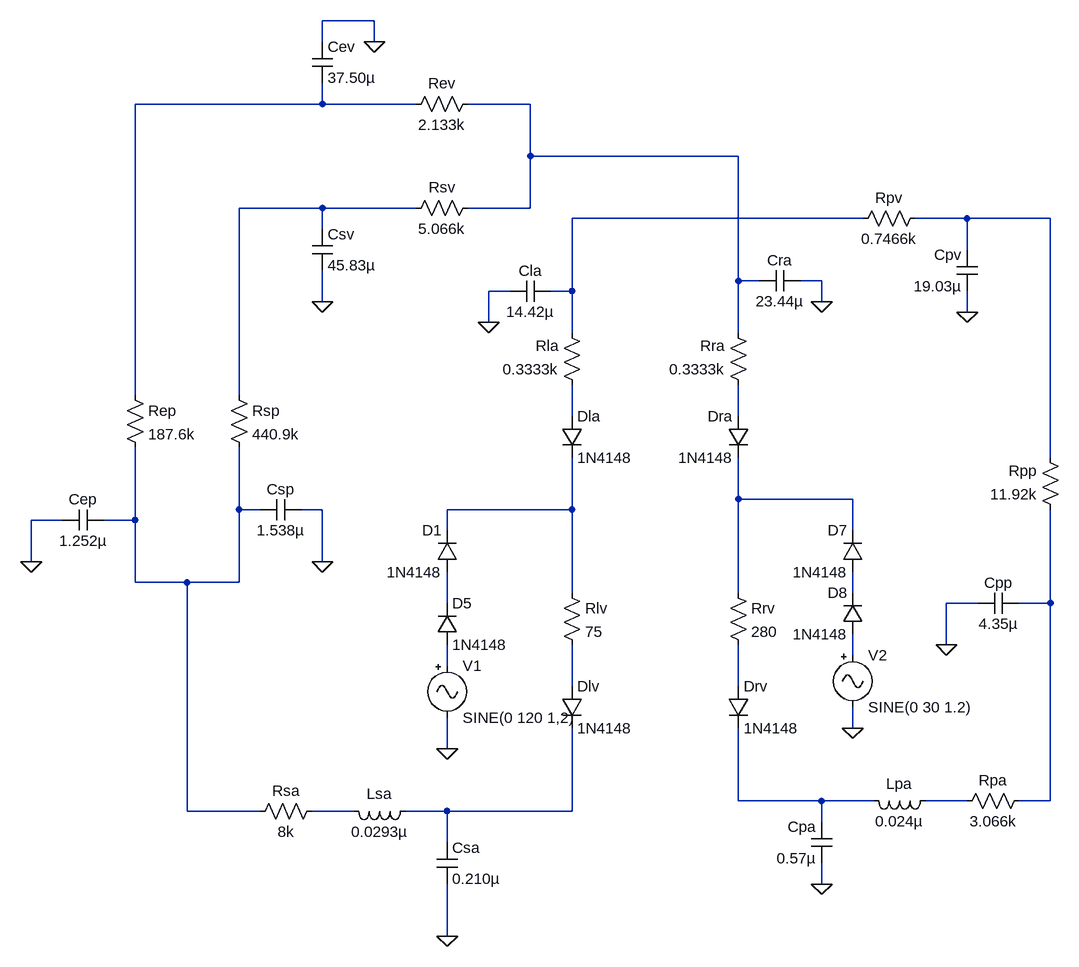
[diagram p0: schematic circuitop.asc]
circuitop.asc, the LTspice schematic file:
Version 4
SHEET 1 2712 1632
WIRE 672 -336 592 -336
WIRE 592 -304 592 -336
WIRE 672 -304 672 -336
WIRE 592 -208 592 -240
WIRE 592 -208 304 -208
WIRE 736 -208 592 -208
WIRE 912 -208 816 -208
WIRE 912 -128 912 -208
WIRE 1232 -128 912 -128
WIRE 592 -48 464 -48
WIRE 736 -48 592 -48
WIRE 912 -48 912 -128
WIRE 912 -48 816 -48
WIRE 1424 -32 976 -32
WIRE 1584 -32 1504 -32
WIRE 1712 -32 1584 -32
WIRE 592 -16 592 -48
WIRE 1584 16 1584 -32
WIRE 1232 64 1232 -128
WIRE 1264 64 1232 64
WIRE 1360 64 1328 64
WIRE 880 80 848 80
WIRE 976 80 976 -32
WIRE 976 80 944 80
WIRE 592 96 592 48
WIRE 1360 96 1360 64
WIRE 1584 112 1584 80
WIRE 848 128 848 80
WIRE 976 144 976 80
WIRE 1232 144 1232 64
WIRE 304 240 304 -208
WIRE 464 240 464 -48
WIRE 976 272 976 224
WIRE 1232 272 1232 224
WIRE 1712 336 1712 -32
WIRE 1232 400 1232 336
WIRE 1408 400 1232 400
WIRE 464 416 464 320
WIRE 496 416 464 416
WIRE 592 416 560 416
WIRE 976 416 976 336
WIRE 976 416 784 416
WIRE 192 432 144 432
WIRE 304 432 304 320
WIRE 304 432 256 432
WIRE 784 448 784 416
WIRE 1408 448 1408 400
WIRE 144 496 144 432
WIRE 592 496 592 416
WIRE 304 528 304 432
WIRE 384 528 304 528
WIRE 464 528 464 416
WIRE 464 528 384 528
WIRE 976 544 976 416
WIRE 1232 544 1232 400
WIRE 1408 544 1408 512
WIRE 784 560 784 512
WIRE 1600 560 1552 560
WIRE 1712 560 1712 416
WIRE 1712 560 1664 560
WIRE 1552 624 1552 560
WIRE 1408 640 1408 608
WIRE 784 656 784 624
WIRE 976 688 976 624
WIRE 1232 688 1232 624
WIRE 1408 752 1408 720
WIRE 784 784 784 736
WIRE 1232 864 1232 752
WIRE 1360 864 1232 864
WIRE 1440 864 1360 864
WIRE 1584 864 1520 864
WIRE 1712 864 1712 560
WIRE 1712 864 1664 864
WIRE 384 880 384 528
WIRE 496 880 384 880
WIRE 640 880 576 880
WIRE 784 880 720 880
WIRE 976 880 976 752
WIRE 976 880 784 880
WIRE 1360 896 1360 864
WIRE 784 928 784 880
WIRE 1360 992 1360 960
WIRE 784 1072 784 992
FLAG 784 784 0
FLAG 848 128 0
FLAG 1552 624 0
FLAG 144 496 0
FLAG 672 -304 0
FLAG 1408 752 0
FLAG 1360 96 0
FLAG 1360 992 0
FLAG 1584 112 0
FLAG 784 1072 0
FLAG 592 496 0
FLAG 592 96 0
SYMBOL res 832 -224 R90
WINDOW 0 0 56 VBottom 2
WINDOW 3 32 56 VTop 2
SYMATTR InstName Rev
SYMATTR Value 2.133k
SYMBOL res 832 -64 R90
WINDOW 0 0 56 VBottom 2
WINDOW 3 32 56 VTop 2
SYMATTR InstName Rsv
SYMATTR Value 5.066k
SYMBOL res 288 224 R0
SYMATTR InstName Rep
SYMATTR Value 187.6k
SYMBOL res 592 864 R90
WINDOW 0 0 56 VBottom 2
WINDOW 3 32 56 VTop 2
SYMATTR InstName Rsa
SYMATTR Value 8k
SYMBOL res 960 528 R0
SYMATTR InstName Rlv
SYMATTR Value 75
SYMBOL res 448 224 R0
SYMATTR InstName Rsp
SYMATTR Value 440.9k
SYMBOL res 992 240 R180
WINDOW 0 36 76 Left 2
WINDOW 3 36 40 Left 2
SYMATTR InstName Rla
SYMATTR Value 0.3333k
SYMBOL res 1520 -48 R90
WINDOW 0 0 56 VBottom 2
WINDOW 3 32 56 VTop 2
SYMATTR InstName Rpv
SYMATTR Value 0.7466k
SYMBOL res 1728 432 R180
WINDOW 0 36 76 Left 2
WINDOW 3 36 40 Left 2
SYMATTR InstName Rpp
SYMATTR Value 11.92k
SYMBOL res 1680 848 R90
WINDOW 0 0 56 VBottom 2
WINDOW 3 32 56 VTop 2
SYMATTR InstName Rpa
SYMATTR Value 3.066k
SYMBOL res 1248 240 R180
WINDOW 0 36 76 Left 2
WINDOW 3 36 40 Left 2
SYMATTR InstName Rra
SYMATTR Value 0.3333k
SYMBOL cap 576 -304 R0
SYMATTR InstName Cev
SYMATTR Value 37.50µ
SYMBOL cap 576 -16 R0
SYMATTR InstName Csv
SYMATTR Value 45.83µ
SYMBOL cap 256 416 R90
WINDOW 0 0 32 VBottom 2
WINDOW 3 32 32 VTop 2
SYMATTR InstName Cep
SYMATTR Value 1.252µ
SYMBOL cap 1376 960 R180
WINDOW 0 24 56 Left 2
WINDOW 3 24 8 Left 2
SYMATTR InstName Cpa
SYMATTR Value 0.57µ
SYMBOL cap 1328 48 R90
WINDOW 0 0 32 VBottom 2
WINDOW 3 32 32 VTop 2
SYMATTR InstName Cra
SYMATTR Value 23.44µ
SYMBOL cap 944 64 R90
WINDOW 0 0 32 VBottom 2
WINDOW 3 32 32 VTop 2
SYMATTR InstName Cla
SYMATTR Value 14.42µ
SYMBOL cap 1600 80 R180
WINDOW 0 24 56 Left 2
WINDOW 3 24 8 Left 2
SYMATTR InstName Cpv
SYMATTR Value 19.03µ
SYMBOL cap 1664 544 R90
WINDOW 0 0 32 VBottom 2
WINDOW 3 32 32 VTop 2
SYMATTR InstName Cpp
SYMATTR Value 4.35µ
SYMBOL cap 768 928 R0
SYMATTR InstName Csa
SYMATTR Value 0.210µ
SYMBOL cap 560 400 R90
WINDOW 0 0 32 VBottom 2
WINDOW 3 32 32 VTop 2
SYMATTR InstName Csp
SYMATTR Value 1.538µ
SYMBOL ind 736 864 R90
WINDOW 0 5 56 VBottom 2
WINDOW 3 32 56 VTop 2
SYMATTR InstName Lsa
SYMATTR Value 0.0293µ
SYMBOL ind 1536 848 R90
WINDOW 0 5 56 VBottom 2
WINDOW 3 32 56 VTop 2
SYMATTR InstName Lpa
SYMATTR Value 0.024µ
SYMBOL diode 800 512 R180
WINDOW 0 24 64 Left 2
WINDOW 3 24 0 Left 2
SYMATTR InstName D1
SYMATTR Value 1N4148
SYMBOL diode 1216 688 R0
SYMATTR InstName Drv
SYMATTR Value 1N4148
SYMBOL diode 1248 272 M0
SYMATTR InstName Dra
SYMATTR Value 1N4148
SYMBOL diode 960 688 R0
SYMATTR InstName Dlv
SYMATTR Value 1N4148
SYMBOL diode 768 624 M180
WINDOW 0 24 64 Left 2
WINDOW 3 24 0 Left 2
SYMATTR InstName D5
SYMATTR Value 1N4148
SYMBOL diode 960 272 R0
SYMATTR InstName Dla
SYMATTR Value 1N4148
SYMBOL diode 1424 512 R180
WINDOW 0 24 64 Left 2
WINDOW 3 24 0 Left 2
SYMATTR InstName D7
SYMATTR Value 1N4148
SYMBOL diode 1424 608 R180
WINDOW 0 24 64 Left 2
WINDOW 3 24 0 Left 2
SYMATTR InstName D8
SYMATTR Value 1N4148
SYMBOL Misc\\signal 784 640 R0
WINDOW 123 0 0 Left 2
WINDOW 39 0 0 Left 2
SYMATTR InstName V1
SYMATTR Value SINE(0 120 1,2)
SYMBOL Misc\\signal 1408 624 R0
WINDOW 123 0 0 Left 2
WINDOW 39 0 0 Left 2
SYMATTR InstName V2
SYMATTR Value SINE(0 30 1.2)
SYMBOL res 1216 528 R0
SYMATTR InstName Rrv
SYMATTR Value 280

The netlist it stands for:
* circuitop.asc
Rev N002 N001 2.133k
Rsv N002 N003 5.066k
Rep N001 N009 187.6k
Rsa N020 N009 8k
Rlv N010 N016 75
Rsp N003 N009 440.9k
Rla N006 N004 0.3333k
Rpv N005 N004 0.7466k
Rpp N013 N005 11.92k
Rpa N013 N019 3.066k
Rra N007 N002 0.3333k
Cev 0 N001 37.50µ
Csv N003 0 45.83µ
Cep N009 0 1.252µ
Cpa 0 N018 0.57µ
Cra 0 N002 23.44µ
Cla N004 0 14.42µ
Cpv 0 N005 19.03µ
Cpp N013 0 4.35µ
Csa N021 0 0.210µ
Csp 0 N009 1.538µ
Lsa N021 N020 0.0293µ
Lpa N019 N018 0.024µ
D1 N012 N010 1N4148
Drv N017 N018 1N4148
Dra N007 N008 1N4148
Dlv N016 N021 1N4148
D5 N015 N012 1N4148
Dla N006 N010 1N4148
D7 N011 N008 1N4148
D8 N014 N011 1N4148
V1 N015 0 SINE(0 120 1,2)
V2 N014 0 SINE(0 30 1.2)
Rrv N008 N017 280
.model D D
.lib standard.dio
.backanno
.end